# EasyEDA Pro project ProProject_2024电赛备赛清单_Wang01_2024-08-05.epro, schematic Schematic7
Create Date: 2024-07-20; Page Name: P1; Project Name: 2024电赛备赛清单_Wang01; Schematic Name: Schematic7; Update Date: 2024-07-22; Company: 嘉立创EDA; Page Size: A4; Version: V1.0
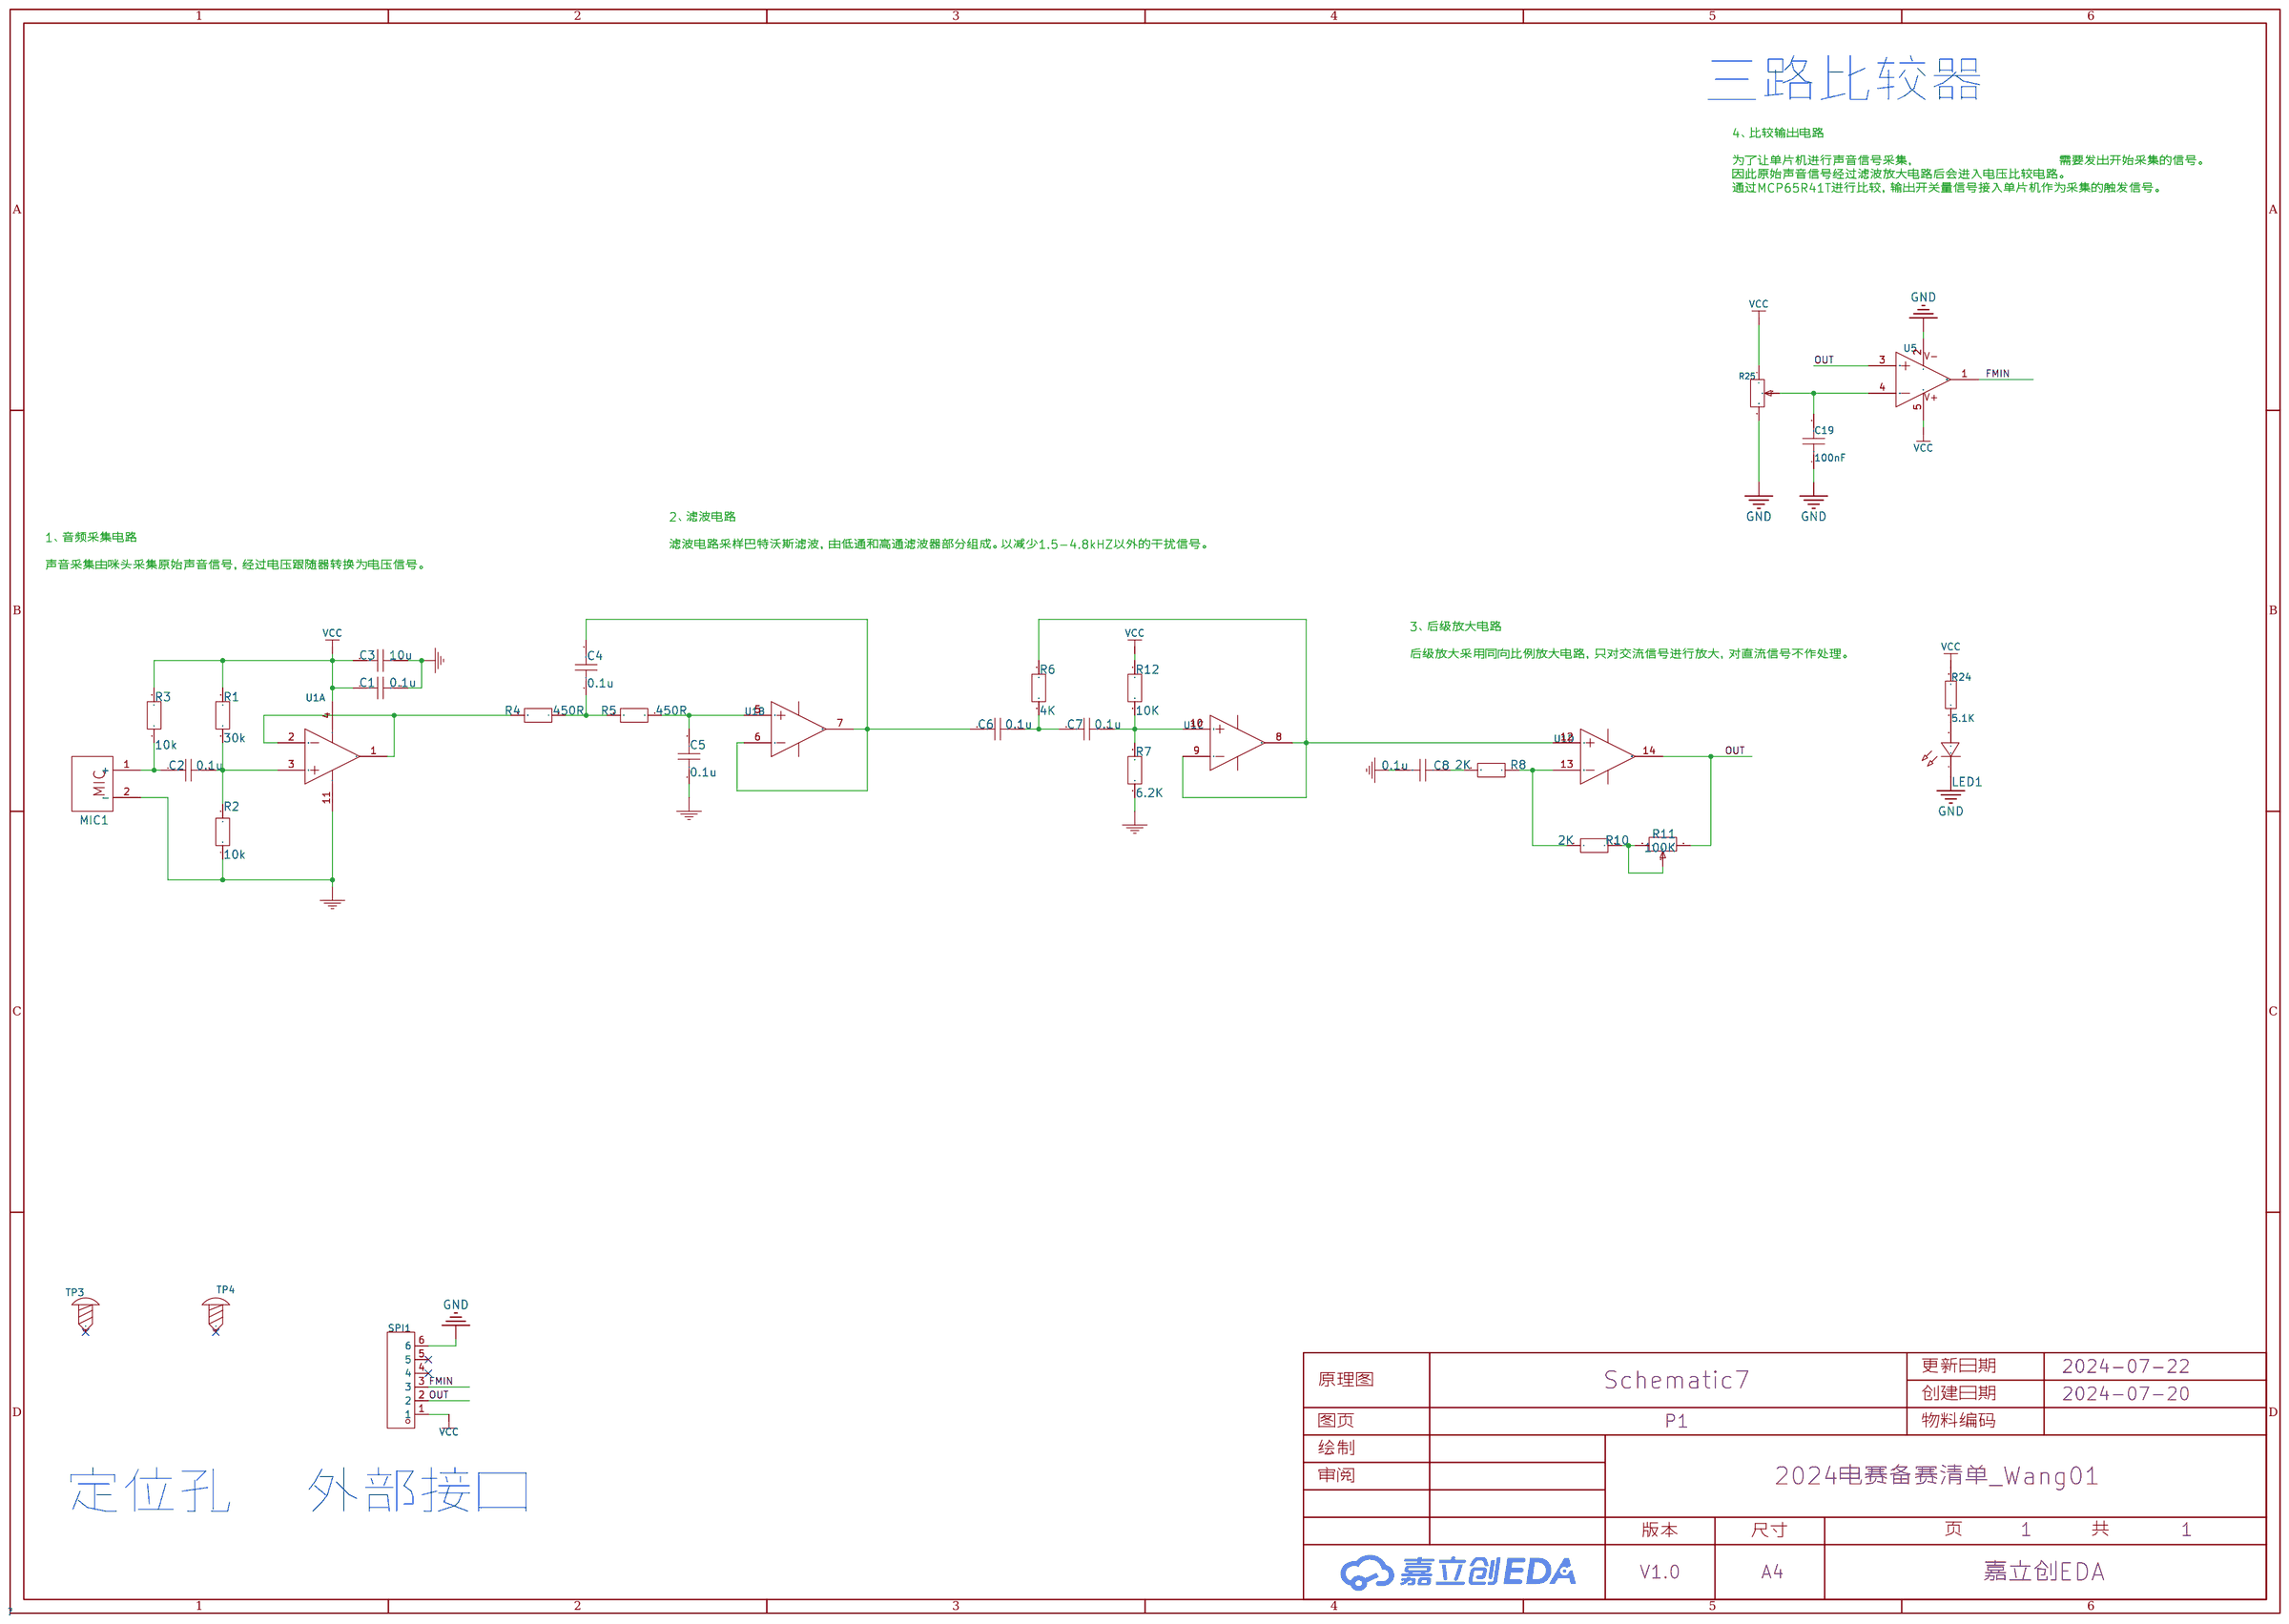
[diagram p6: schematic sheet]

## Parts
C1  0.1u  [C0805]
C2  0.1u  [C0805]
C3  10u  [C0805]
C4  0.1u  [C0805]
C5  0.1u  [C0805]
C6  0.1u  [C0805]
C7  0.1u  [C0805]
C8  0.1u  [C0805]
C19  100nF  [C0805]
LED1  -  [LED_0603]
MIC1  GMI6050P-52DB  [MIC-TH_BD6.0-P2.00]
R1  30k  [R0805]
R2  10k  [R0805]
R3  10k  [R0805]
R4  450R  [R0805]
R5  450R  [R0805]
R6  4K  [R0805]
R7  6.2K  [R0805]
R8  2K  [R0805]
R10  2K  [R0805]
R11  100K  [电位器]
R12  10K  [R0805]
R24  5.1K  [R0805]
R25  -  [电位器]
SPI1  X8821WR-06SL-N0SN  [CONN-TH_X8821WR-06SL-N0SN]
TP3  -  [M3螺丝]
TP4  -  [M3螺丝]
U1  RS8554XP  [SOIC-14_L8.7-W3.9-P1.27-LS6.0-BL]  (sections 1,2,3,4)
U5  -  [SOT-23-5_L3.0-W1.6-P0.95-LS2.8-TR]

## Library data of the parts
C1 C2 C4-C8 = 0.1u
C3 = 10u
C19 = CAP_0805: Supplier Footprint: 0805
LED1 = LED_0603-R: Supplier Footprint: 0603
MIC1 = GMI6050P-52DB: Supplier: LCSC; Supplier Part: C233947; Manufacturer: INGHAi(赢海); Manufacturer Part: GMI6050P-52db; JLCPCB Part Class: Extended Part; link: https://so.szlcsc.com/global.html?k=C233947amp;ref=editor
R1 = 30k
R2 R3 = 10k
R4 R5 = 450R
R6-R8 R10 R12 = 2K
R11 = 500K: Supplier: LCSC; Manufacturer: ReliaPro; Manufacturer Part: RHOS 3296W-1-504LF; Supplier Part: C5034; link: https://so.szlcsc.com/global.html?k=C5034amp;ref=editor
R24 = Res_0805: Supplier Footprint: 0805
R25 = 3296W-1-105_C5027: 阻值:-;功率:-;; LCSC Part Name: 1MΩ ±0.25% ±250ppm/℃; Supplier Part: C5027; Manufacturer Part: 3296W-1-105; Supplier Footprint: 3296W; JLCPCB Part Class: 扩展库; Supplier: LCSC
SPI1 = X8821WR-06SL-N0SN: 参考系列:-;间距:2.5mm;插针结构:1x6P;排数:1;每排PIN数:6;行距:-;公母:公型插针;安装方式:弯插;额定电流:3A;触头材质:黄铜;触头镀层:锡;工作温度范围:-25℃~+85℃;焊接温度(最大值):260℃;; LCSC Part Name: 2.5mm 1x6P 弯插 XH 带锁扣; Supplier Part: C519136; Manufacturer: XKB Connectivity(中国星坤); Supplier Footprint: 弯插,P=2.5mm; JLCPCB Part Class: Extended Part; Datasheet: https://atta.szlcsc.com/upload/public/pdf/source/20211009/332DC6FA62F35EC7E2F9194EFB1273DD.pdf; Supplier: LCSC; Pitch: 2.5mm; Pins Structure: 1x6P; Number of Rows: 1; Number of PINs Per Row: 6; Gender: 公型插针; Mounting Style: 弯插; Current Rating (Max): 3A; Contact Material: 黄铜; Contact Plating: 锡; Operating Temperature Range: -25℃~+85℃; Welding Temperature (Max): 260℃
TP3 TP4 = M3螺丝: Supplier Footprint: 插件
U1 = RS8554XP: 放大器组数:4;增益带宽积(GBP):4.5MHz;压摆率(SR):2.7V/us;; Supplier Part: C236997; Manufacturer: RUNIC(润石); Supplier Footprint: SOIC-14; JLCPCB Part Class: 扩展库; Datasheet: https://atta.szlcsc.com/upload/public/pdf/source/20180704/C236997_BF74C37E35A725D699BA91BFBED4064A.pdf; Supplier: LCSC; Number of Circuits: 4; Gain Bandwidth Product(GBP): 4.5MHz; Slew Rate(SR): 2.7V/us; Supply Voltage: 2.7V~5.5V; Operating Temperature: -40℃~+125℃
U5 = RS8551

## Nets
GND: C1.2 C3.2 C5.1 C8.2 C19.1 LED1.1(C) MIC1.2(-) R2.1 R7.2 R25.3 SPI1.6 U1.11(V-) U5.2(V-)
VCC: C1.1 C3.1 R1.2 R3.2 R12.1 R24.2 R25.1 SPI1.1 U1.4(V+) U5.5(Vcc)
FMIN: SPI1.3 U5.1(OUTPUT 1)
OUT: R11.1 SPI1.2 U1.14(OUTD) U5.3(INPUT1(+))
$1N803: LED1.2(A) R24.1
$1N1803: C19.2 R25.2 U5.4(INPUT1(-))
$1N4272: C4.1 R4.1 R5.2
$1N4275: C6.1 C7.2 R6.2
$1N4279: R10.1 R11.2 R11.3
$1N4449: C8.1 R8.2
Net-(C2-1): C2.1 MIC1.1(+) R3.1
Net-(C2-2): C2.2 R1.1 R2.2 U1.3(INA+)
Net-(C4-2): C4.2 C6.2 U1.6(INB-) U1.7(OUTB)
Net-(C5-2): C5.2 R5.1 U1.5(INB+)
Net-(C7-1): C7.1 R7.1 R12.2 U1.10(INC+)
Net-(R4-2): R4.2 U1.1(OUTA) U1.2(INA-)
Net-(R6-1): R6.1 U1.8(OUTC) U1.9(INC-) U1.12(IND+)
Net-(R8-1): R8.1 R10.2 U1.13(IND-)

Not connected (* = marked no-connect by the designer): SPI1 4* 5*; TP3 1*; TP4 1*

## Notes on the sheet
- 三路比较器
- 4、比较输出电路
  为了让单片机进行声音信号采集，                      需要发出开始采集的信号。
  因此原始声音信号经过滤波放大电路后会进入电压比较电路。
  通过MCP65R41T进行比较，输出开关量信号接入单片机作为采集的触发信号。
- 2、滤波电路
  滤波电路采样巴特沃斯滤波，由低通和高通滤波器部分组成。以减少1.5-4.8kHZ以外的干扰信号。
- 1、音频采集电路
  声音采集由咪头采集原始声音信号，经过电压跟随器转换为电压信号。
- 3、后级放大电路
  后级放大采用同向比例放大电路，只对交流信号进行放大，对直流信号不作处理。
- 定位孔
- 外部接口
